# Altium schematic sheet Sheet2.SchDoc
size A4; SheetNumber: 1; SheetTotal: 2
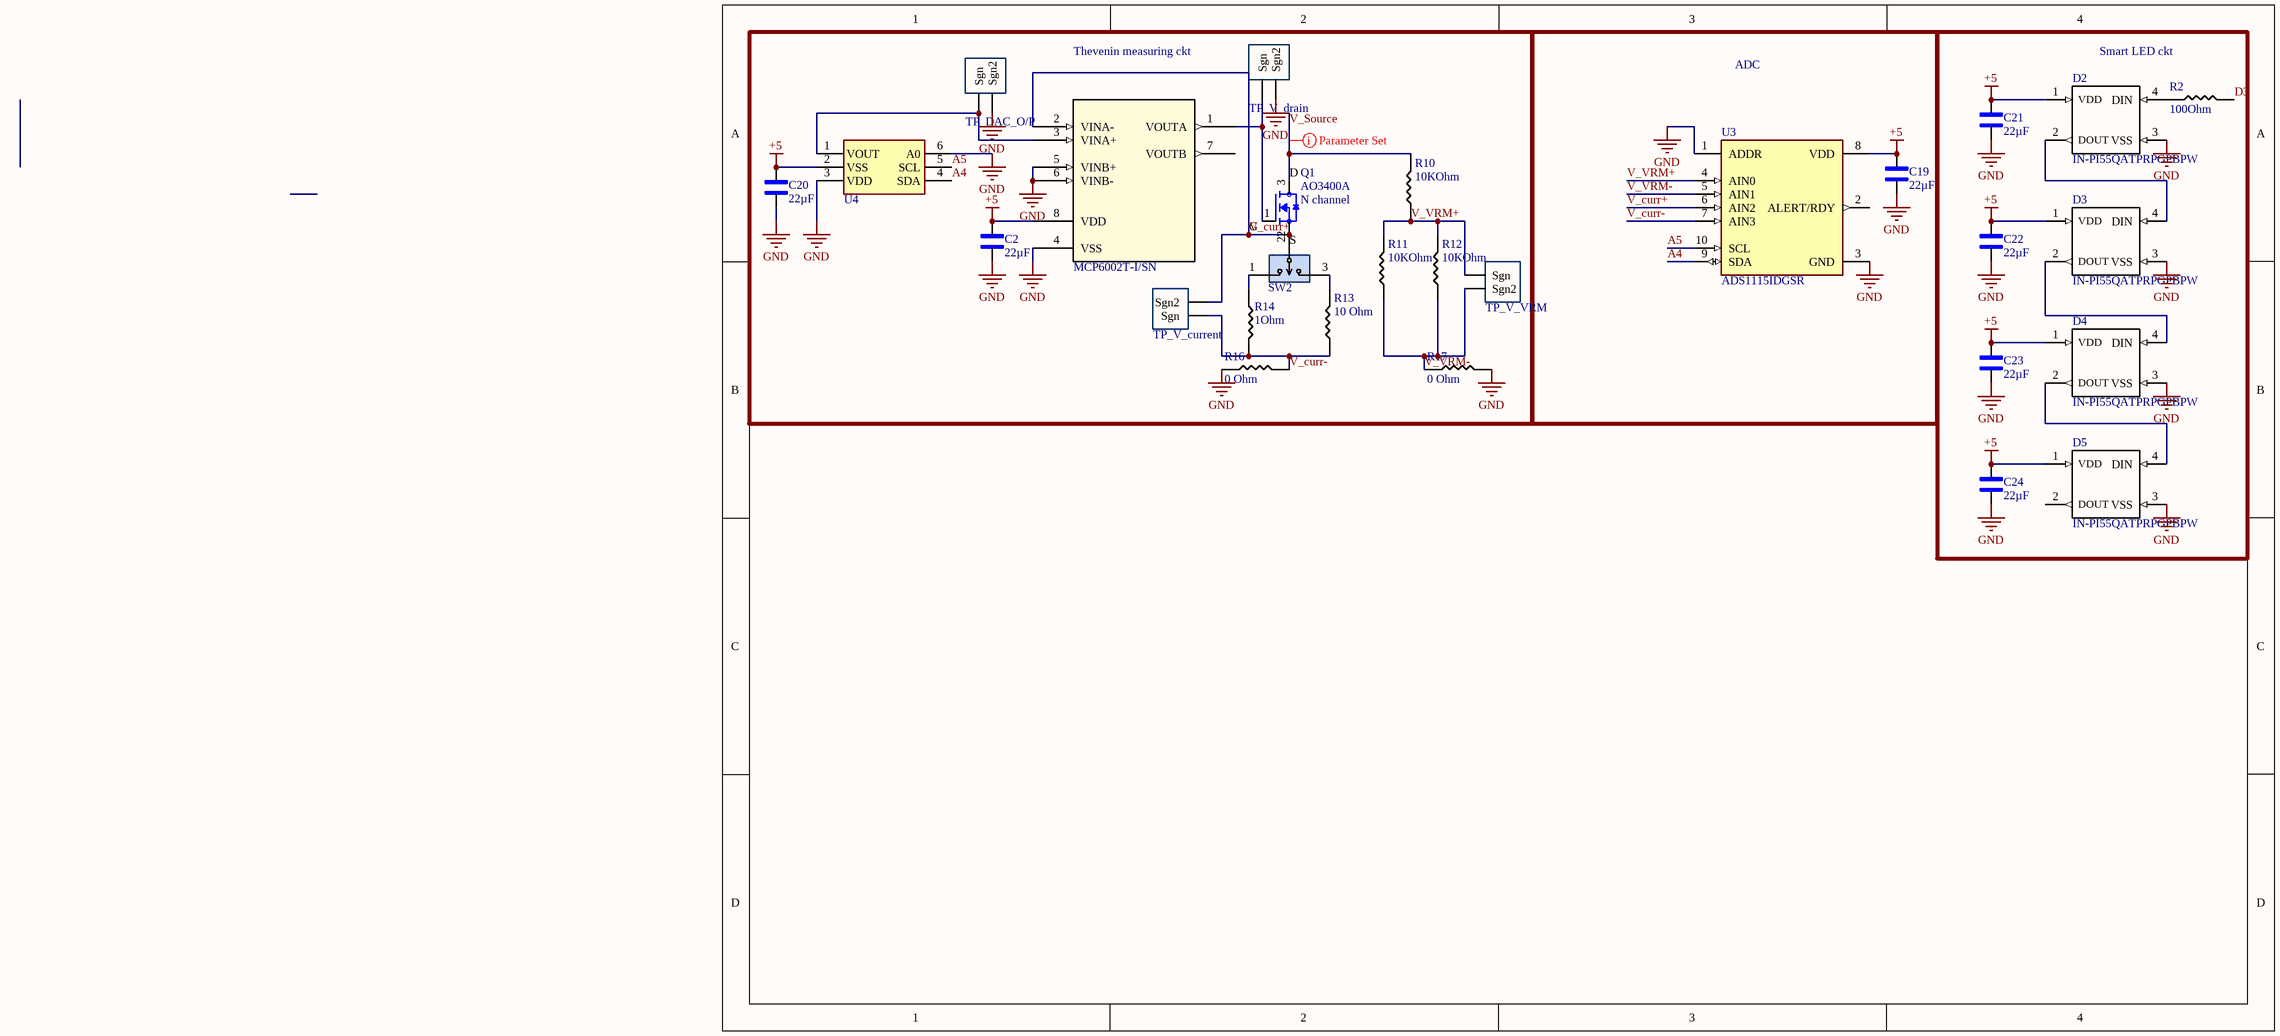
[diagram p0: Sheet2.SchDoc]

## Parts
?  MCP6002T-I/SN  [SOIC127P600X175-8N]
C2  value 22µF  [1206_Passive_Capacitor]  (hidden comment: C_22uF_1206)
C19  value 22µF  [1206_Passive_Capacitor]  (hidden comment: C_22uF_1206)
C20  value 22µF  [1206_Passive_Capacitor]  (hidden comment: C_22uF_1206)
C21  value 22µF  [1206_Passive_Capacitor]  (hidden comment: C_22uF_1206)
C22  value 22µF  [1206_Passive_Capacitor]  (hidden comment: C_22uF_1206)
C23  value 22µF  [1206_Passive_Capacitor]  (hidden comment: C_22uF_1206)
C24  value 22µF  [1206_Passive_Capacitor]  (hidden comment: C_22uF_1206)
D2  IN-PI55QATPRPGPBPW  [SERIAL_LED - duplicate]
D3  IN-PI55QATPRPGPBPW  [SERIAL_LED - duplicate]
D4  IN-PI55QATPRPGPBPW  [SERIAL_LED - duplicate]
D5  IN-PI55QATPRPGPBPW  [SERIAL_LED - duplicate]
Q1  AO3400A  value N channel  [N-MOSFET]
R2  100Ohm  [1206_Passive_Resitor]
R10  value 10KOhm  [1206_Passive_Resitor]  (hidden comment: 10k)
R11  value 10KOhm  [1206_Passive_Resitor]  (hidden comment: 10k)
R12  value 10KOhm  [1206_Passive_Resitor]  (hidden comment: 10k)
R13  10 Ohm  [1206_Passive_Resitor]
R14  value 1Ohm  [1206_Passive_Resitor]  (hidden comment: 1 Ohm)
R16  0 Ohm  [1206_Passive_Resitor]
R17  0 Ohm  [1206_Passive_Resitor]
SW2  SW_3Pin_100mil_Switch  [3_PIN_100mil]  (value not drawn)
TP_DAC_O/P  10x Probe TP  [TP_Diff_Probe]  (value not drawn)
TP_V_current  10x Probe TP  [TP_Diff_Probe]  (value not drawn)
TP_V_drain  10x Probe TP  [TP_Diff_Probe]  (value not drawn)
TP_V_VRM  10x Probe TP  [TP_Diff_Probe]  (value not drawn)
U3  ADS1115IDGSR  [ADC_ADS1115IDGSR]
U4  DAC IC  [MCP4725]  (value not drawn)

## Blocks framed on the sheet
Thevenin measuring ckt: ? C2 C20 Q1 R10-R14 R16 R17 SW2 TP_DAC_O/P TP_V_current TP_V_drain TP_V_VRM U4
ADC: C19 U3
Smart LED ckt: C21-C24 D2-D5 R2

## Nets
+5: ?.8(VDD) C2.1 C19.1 C20.1 C21.1 C22.1 C23.1 C24.1 D2.1(VDD) D3.1(VDD) D4.1(VDD) D5.1(VDD) U3.8(VDD) U4.2(VSS)
GND: ?.4(VSS) ?.5(VINB+) ?.6(VINB-) C2.2 C19.2 C20.2 C21.2 C22.2 C23.2 C24.2 D2.3(VSS) D3.3(VSS) D4.3(VSS) D5.3(VSS) R16.1 R17.2 TP_DAC_O/P.2(Sgn2) TP_V_drain.2(Sgn2) U3.1(ADDR) U3.3(GND) U4.3(VDD) U4.6(A0)
A4: U3.9(SDA) U4.4(SDA)
A5: U3.10(SCL) U4.5(SCL)
D3: R2.2
V_curr+: ?.2(VINA-) Q1.2(S) SW2.2 TP_V_current.2(Sgn2) U3.6(AIN2)
V_curr-: R13.1 R14.2 R16.2 TP_V_current.1(Sgn) U3.7(AIN3)
V_Source: Q1.3(D) R10.2
V_VRM+: R10.1 R11.2 R12.2 TP_V_VRM.1(Sgn) U3.4(AIN0)
V_VRM-: R11.1 R12.1 R17.1 TP_V_VRM.2(Sgn2) U3.5(AIN1)
Net?_1: ?.1(VOUTA) Q1.1(G) TP_V_drain.1(Sgn)
Net?_3: ?.3(VINA+) TP_DAC_O/P.1(Sgn) U4.1(VOUT)
NetD2_2: D2.2(DOUT) D3.4(DIN)
NetD2_4: D2.4(DIN) R2.1
NetD3_2: D3.2(DOUT) D4.4(DIN)
NetD4_2: D4.2(DOUT) D5.4(DIN)
NetR13_2: R13.2 SW2.3
NetR14_1: R14.1 SW2.1

Not connected (* = marked no-connect by the designer): ? 7(VOUTB); D5 2(DOUT); U3 2(ALERT/RDY)

## Layout directives
rule Width Constraint [Pref Width = 20mil    Min Width = 20mil    Max Width = 20mil]: V_Source

## Library data of the parts
? = U_MCP6002T-I/SN: 0.6 V/us 2 1MHz 1.8V ~ 6V 100μA General Purpose SOIC-8_150mil  Operational Amplifier ROHS; Mfr: Microchip; MFR Part #: MCP6002T-I/SN; DataSheet: https://ww1.microchip.com/downloads/en/DeviceDoc/MCP6001-1R-1U-2-4-1-MHz-Low-Power-Op-Amp-DS20001733L.pdf; LCSC Part#: C7377; Type: Basic
C2 C19-C24 = CMP-001-00089-1: 22uF ±10% 25V X5R 1206 Multilayer Ceramic Capacitors MLCC - SMD/SMT RoHS; MFR Part #: CL31A226KAHNNNE; Type: basic; Design Item ID: C_22uF_1206; Datasheet: https://datasheet.lcsc.com/lcsc/1811031514_Samsung-Electro-Mechanics-CL31A226KAHNNNE_C12891.pdf; LCSC Part#: C12891; Component Type: Standard; Pins: 2; Source: ECEN5730Lib_2023_05_DS.SchLib
D2-D5 = LED_Smart: LIGHT EMITTING DIODES (LED) RGB 620~630NM RED, 520~530NM GREEN, 465~475NM BLUE 600MCD@16MARED,1200MCD@16MAGREEN,300MCD@16MABLUE TOP VIEW SMD-4 ROHS; MFR Part #: XL-5050RGBC-WS2812B; Manufacturer: XINGLIGHT; LCSC Part#: C2843785; DataSheet: https://datasheet.lcsc.com/lcsc/2301111130_XINGLIGHT-XL-5050RGBC-WS2812B_C2843785.pdf
Q1 = Q_Nch_MOSFET: MOSFET N Trench 30V 5.7A 1.5V @ 250uA 26.5 m? @ 5.7A,10V SOT-23-3L RoHS; Type: Basic; LCSC Part#: C20917; Datasheet: https://datasheet.lcsc.com/szlcsc/Alpha-Omega-Semicon-AOS-AO3400A_C20917.pdf; MFR Part #: AO3400A
R2 = R_100Ohm_1206: 100Ω ±1% 0.25W ±100ppm/℃ 1206 Chip Resistor - Surface Mount RoHS; MFR Part #: 1206W4F1000T5E; LCSC Part#: C17901; Datasheet: https://datasheet.lcsc.com/lcsc/2206010145_UNI-ROYAL-Uniroyal-Elec-1206W4F1000T5E_C17901.pdf; Type: Basic; Value: 100Ohm
R10-R12 = R_10KOhm_1206: 10 kOhms ±5% 0.25W, 1/4W Chip Resistor 1206 (3216 Metric) Automotive AEC-Q200 Thick Film; MFR Part #: RMCF1206FT10K0; Digikey Link: https://www.digikey.com/en/products/detail/stackpole-electronics-inc/RMCF1206FT10K0/1759669; LCSC Part#: C17902; Type: Basic
R13 = R_10Ohm_1206: CHIP RESISTOR - SURFACE MOUNT 0.1OHMS ±1% 1/4W 1206 ROHS; MFR Part #: 1206W4F100JT5E; Datasheet: https://datasheet.lcsc.com/szlcsc/Uniroyal-Elec-1206W4F100JT5E_C17903.pdf; LCSC Part#: C17903; Type: Basic; Value: 10 Ohm
R14 = R_1Ohm_1206: 1Ω ±5% 0.25W ±400ppm/℃ 1206 Chip Resistor - Surface Mount RoHS; MFR Part #: 1206W4J010JT5E; LCSC Part#: C1409; Datasheet: https://datasheet.lcsc.com/lcsc/1810301410_UNI-ROYAL-Uniroyal-Elec-1206W4J010JT5E_C1409.pdf; Type: Extended
R16 R17 = R_0Ohm_1206: CHIP RESISTOR - SURFACE MOUNT 0OHMS ±1% 1/4W 1206 ROHS; MFR Part #: 1206W4F0000T5E; Datasheet: https://datasheet.lcsc.com/szlcsc/Uniroyal-Elec-1206W4F0000T5E_C17888.pdf; LCSC Part#: C17888; Type: Basic; Mouser link: https://www.mouser.com/ProductDetail/Royalohm/1206W4F0000T5E?qs=e8oIoAS2J1Thbopin%252BsagQ%3D%3D; Value: 0 Ohm
SW2 = CMP-002-00126-1: Connector Header Through Hole 3 position 0.100" (2.54mm); MFR Part #: PREC003SAAN-RC; Value: CONN HEADER VERT 3POS 2.54MM; Type: Extended; LCSC Part#: C49257; Source: ECEN5730Lib_2023_05_DS.SchLib; Pins: 3; Design Item ID: SW_3Pin_100mil_Switch; Component Type: Standard; Digikey Link: https://www.digikey.com/product-detail/en/PREC003SAAN-RC/S1012EC-03-ND/2774851/?itemSeq=304982371
TP_DAC_O/P TP_V_current TP_V_drain TP_V_VRM = TP_Diff_Probe: Test Point 300 mil centers
U3 = U_ADC_ADS1115IDGSR: 16-Bit ADC with Integrated MUX, PGA, Comparator, Oscillator, and Reference 10-VSSOP -40 to 125; MFR Part #: ADS1115IDGSR; Package: MSOP-10 Texas Instruments; LCSC Part#: C37593; SnapEDA_Link: https://www.snapeda.com/parts/ADS1115IDGSR/Texas%20Instruments/view-part/?ref=snap; Type: Extended; DigiKey link: https://www.digikey.com/product-detail/en/texas-instruments/ADS1115IDGSR/296-38849-1-ND/5142969?utm_source=snapeda&utm_medium=aggregator&utm_campaign=symbol; Value: *
U4 = U_MCP4725A0T-E/CH: IC DAC 12BIT V-OUT SOT23-6; Datasheet: https://ww1.microchip.com/downloads/en/DeviceDoc/22039d.pdf; LCSC Part#: C144198; type: Extended; MFR Part #: MCP4725A0T-E/CH